# Altium schematic sheet AMS1117-ADJ.SchDoc: AMS1117-ADJ
size A4; CompanyName: github.com/aKaReZa75; Revision: 1.0; SheetNumber: 1; SheetTotal: 1; Project_Name: Design Template
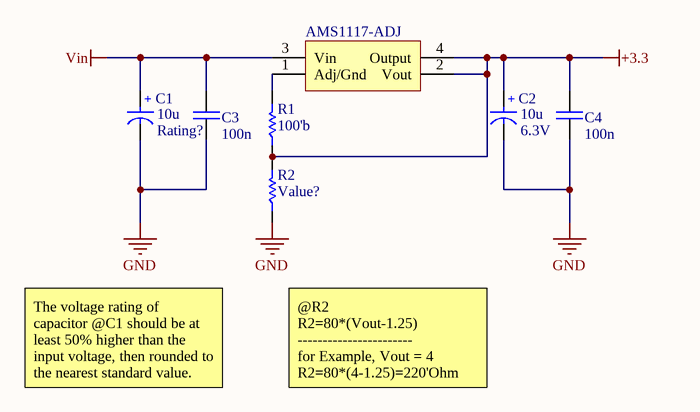
[diagram p0: AMS1117-ADJ.SchDoc]

## Parts
AMS1117-ADJ  3.3V  [SOT223_M]  (value not drawn)
C1  Rating: Rating?  [SMT_C_Tantalum_B]  (hidden comment: 10u)
C2  Rating: 6.3V  [SMT_C_Tantalum_B]  (hidden comment: 10u)
C3  100n  [CAP 0805/2012]
C4  100n  [CAP 0805/2012]
R1  100'b  [RES 0805 (2012X06L)]
R2  Value?  [RES 0805 (2012X06L)]

## Nets
+3.3: AMS1117-ADJ.2(Vout) AMS1117-ADJ.4(Output) C2.1(+) C4.1 R1.1 R2.2
GND: C1.2(-) C2.2(-) C3.2 C4.2 R2.1
Vin: AMS1117-ADJ.3(Vin) C1.1(+) C3.1
NetAMS1117-ADJ_1: AMS1117-ADJ.1(Adj/Gnd) R1.2

## Notes on the sheet
- The voltage rating of capacitor @C1 should be at least 50% higher than the input voltage, then rounded to the nearest standard value.
- @R2
  R2=80*(Vout-1.25)
  -----------------------
  for Example, Vout = 4
  R2=80*(4-1.25)=220'Ohm
- Title:
- Project:
- Drawn by:
- Revision:
- Hossein Bagheri
- Company:
- Sheet
- of

## Library data of the parts
AMS1117-ADJ = IC_Reg_AMS1117_3.3: 1'A Positive voltage regulator; Rating: 1A; Inflow: 5217; Validation: Valid; Type: LDO; Package: SOT223; Value: 3.3V
C1 C2 = Cap_Tantalum: Tantalum Capacitor,TAJ Series-SMD; Inflow: inflow?; Validation: Valid; Package: Package?; Type: Tantalum; Value: 10u
C3 C4 = Cap_Multi_SMD_100nF_0805: Bipolar ceramic capacitor SMD; Inflow: inflow?; Type: MultiLayer; Rating: 50V; Validation: Valid; Package: 0805; Value: 100n
R1 R2 = Res_SMD_0805: Resistor; Inflow: inflow?; Rating: 0.125W; Validation: Valid; Package: 0805; Type: 10%
  R1: Value: 100'b
  R2: Value: Value?